# Altium schematic sheet NB_BaseStation.SchDoc
size A4; SheetNumber: 1; SheetTotal: 1
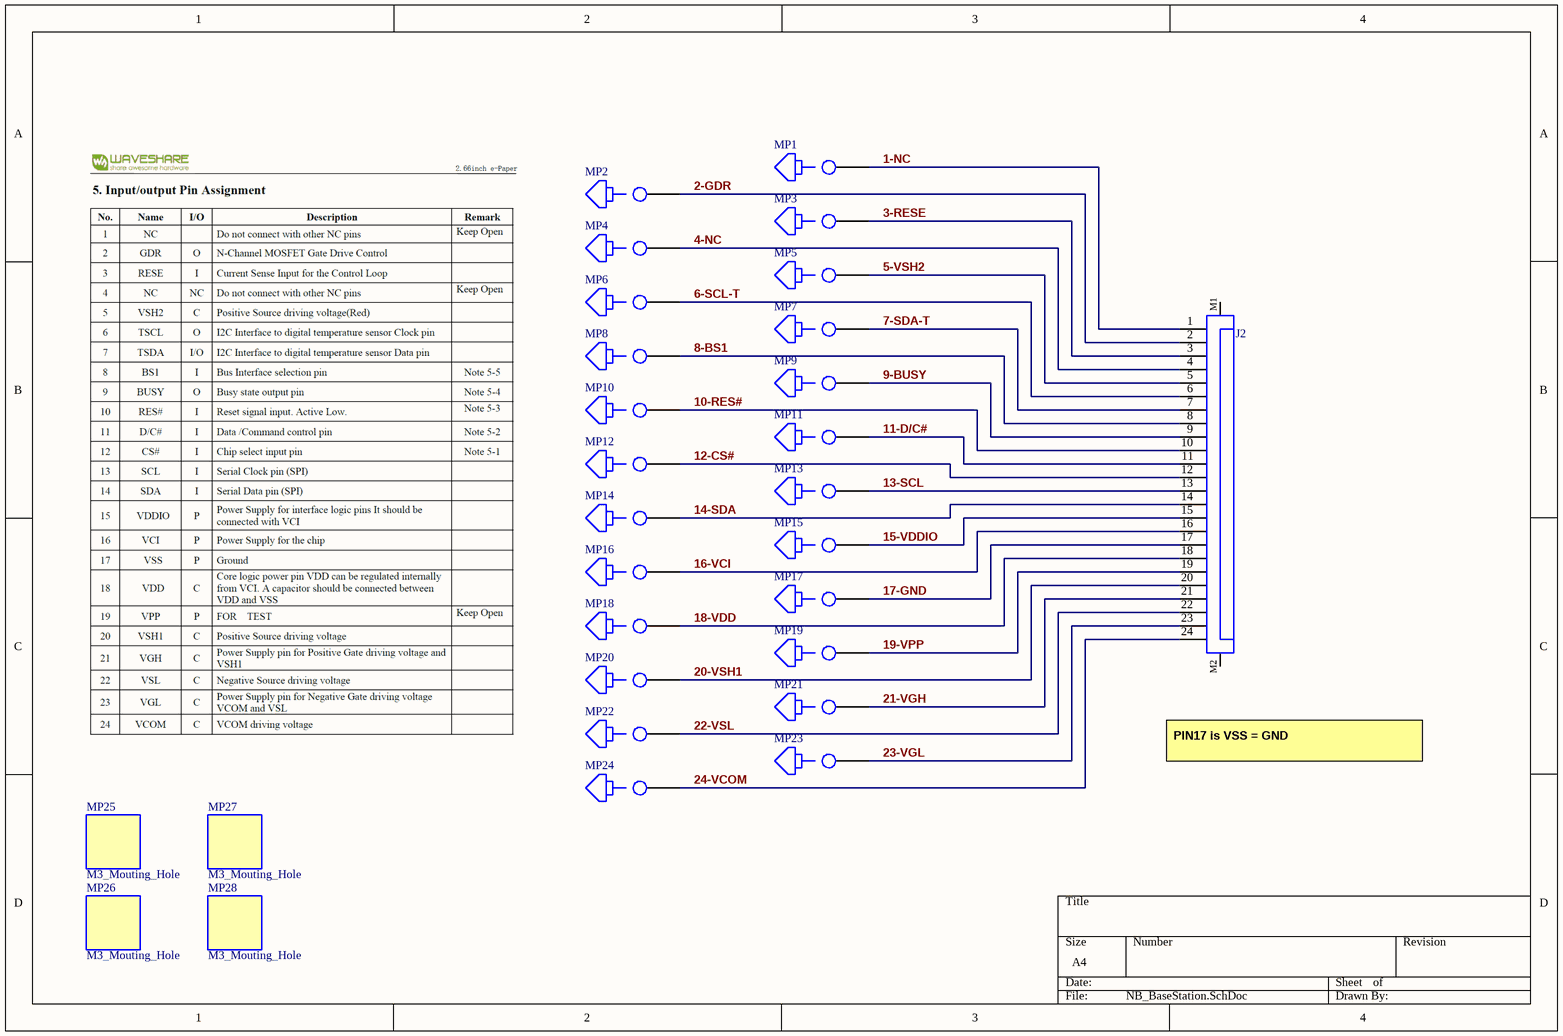
[diagram p0: NB_BaseStation.SchDoc]

## Parts
J2  687124182122  [687124182122]  (value not drawn)
MP1  PH-MVS-4355  [PH-MVS-4355]  (value not drawn)
MP2  PH-MVS-4355  [PH-MVS-4355]  (value not drawn)
MP3  PH-MVS-4355  [PH-MVS-4355]  (value not drawn)
MP4  PH-MVS-4355  [PH-MVS-4355]  (value not drawn)
MP5  PH-MVS-4355  [PH-MVS-4355]  (value not drawn)
MP6  PH-MVS-4355  [PH-MVS-4355]  (value not drawn)
MP7  PH-MVS-4355  [PH-MVS-4355]  (value not drawn)
MP8  PH-MVS-4355  [PH-MVS-4355]  (value not drawn)
MP9  PH-MVS-4355  [PH-MVS-4355]  (value not drawn)
MP10  PH-MVS-4355  [PH-MVS-4355]  (value not drawn)
MP11  PH-MVS-4355  [PH-MVS-4355]  (value not drawn)
MP12  PH-MVS-4355  [PH-MVS-4355]  (value not drawn)
MP13  PH-MVS-4355  [PH-MVS-4355]  (value not drawn)
MP14  PH-MVS-4355  [PH-MVS-4355]  (value not drawn)
MP15  PH-MVS-4355  [PH-MVS-4355]  (value not drawn)
MP16  PH-MVS-4355  [PH-MVS-4355]  (value not drawn)
MP17  PH-MVS-4355  [PH-MVS-4355]  (value not drawn)
MP18  PH-MVS-4355  [PH-MVS-4355]  (value not drawn)
MP19  PH-MVS-4355  [PH-MVS-4355]  (value not drawn)
MP20  PH-MVS-4355  [PH-MVS-4355]  (value not drawn)
MP21  PH-MVS-4355  [PH-MVS-4355]  (value not drawn)
MP22  PH-MVS-4355  [PH-MVS-4355]  (value not drawn)
MP23  PH-MVS-4355  [PH-MVS-4355]  (value not drawn)
MP24  PH-MVS-4355  [PH-MVS-4355]  (value not drawn)
MP25  M3_Mouting_Hole  [M3_Mouting_Hole]  (no BOM)
MP26  M3_Mouting_Hole  [M3_Mouting_Hole]  (no BOM)
MP27  M3_Mouting_Hole  [M3_Mouting_Hole]  (no BOM)
MP28  M3_Mouting_Hole  [M3_Mouting_Hole]  (no BOM)

## Nets
1-NC: J2.1 MP1.1
2-GDR: J2.2 MP2.1
3-RESE: J2.3 MP3.1
4-NC: J2.4 MP4.1
5-VSH2: J2.5 MP5.1
6-SCL-T: J2.6 MP6.1
7-SDA-T: J2.7 MP7.1
8-BS1: J2.8 MP8.1
9-BUSY: J2.9 MP9.1
10-RES#: J2.10 MP10.1
11-D/C#: J2.11 MP11.1
12-CS#: J2.12 MP12.1
13-SCL: J2.13 MP13.1
14-SDA: J2.14 MP14.1
15-VDDIO: J2.15 MP15.1
16-VCI: J2.16 MP16.1
17-GND: J2.17 MP17.1
18-VDD: J2.18 MP18.1
19-VPP: J2.19 MP19.1
20-VSH1: J2.20 MP20.1
21-VGH: J2.21 MP21.1
22-VSL: J2.22 MP22.1
23-VGL: J2.23 MP23.1
24-VCOM: J2.24 MP24.1

Not connected (* = marked no-connect by the designer): J2 M1 M2

## Notes on the sheet
- PIN17 is VSS = GND

## Library data of the parts
J2 = 687124182122: WR-FPC SMT ZIF Horizontal Dual Contact, pitch 0.5mm, Horizontal, 24pins; Manufacturer: Wurth Elektronik; Contact Resistance: 30mΩ; Rated Current: 0.5A; Working Voltage: 50VAC; ComponentLink1Description: Website Link; ComponentLink1URL: https://www.we-online.com/redexpert/article/687124182122?ad; ComponentLink2Description: Datasheet Link; ComponentLink2URL: https://www.we-online.com/redexpert/spec/687124182122?ad; Manufacturer Part Number: 687124182122; Category: FPC Connectors; Match Code: WR-FPC; Mount: Surface Mount; Operating Temperature Max: 85°C; Operating Temperature Min: -55°C; Packaging: Tape and Reel; Length: 14mm; Width: 3.7mm; Height: 0.96mm; Number of Pins: 24; Orientation: Horizontal; Pitch: 0.5mm
MP1-MP24 = PH-MVS-4355: Pogo Pin CONTACT SPRING LOADED SLDR CUP